# EAGLE schematic a2402-4069-overdrive (EAGLE 7.5.0)
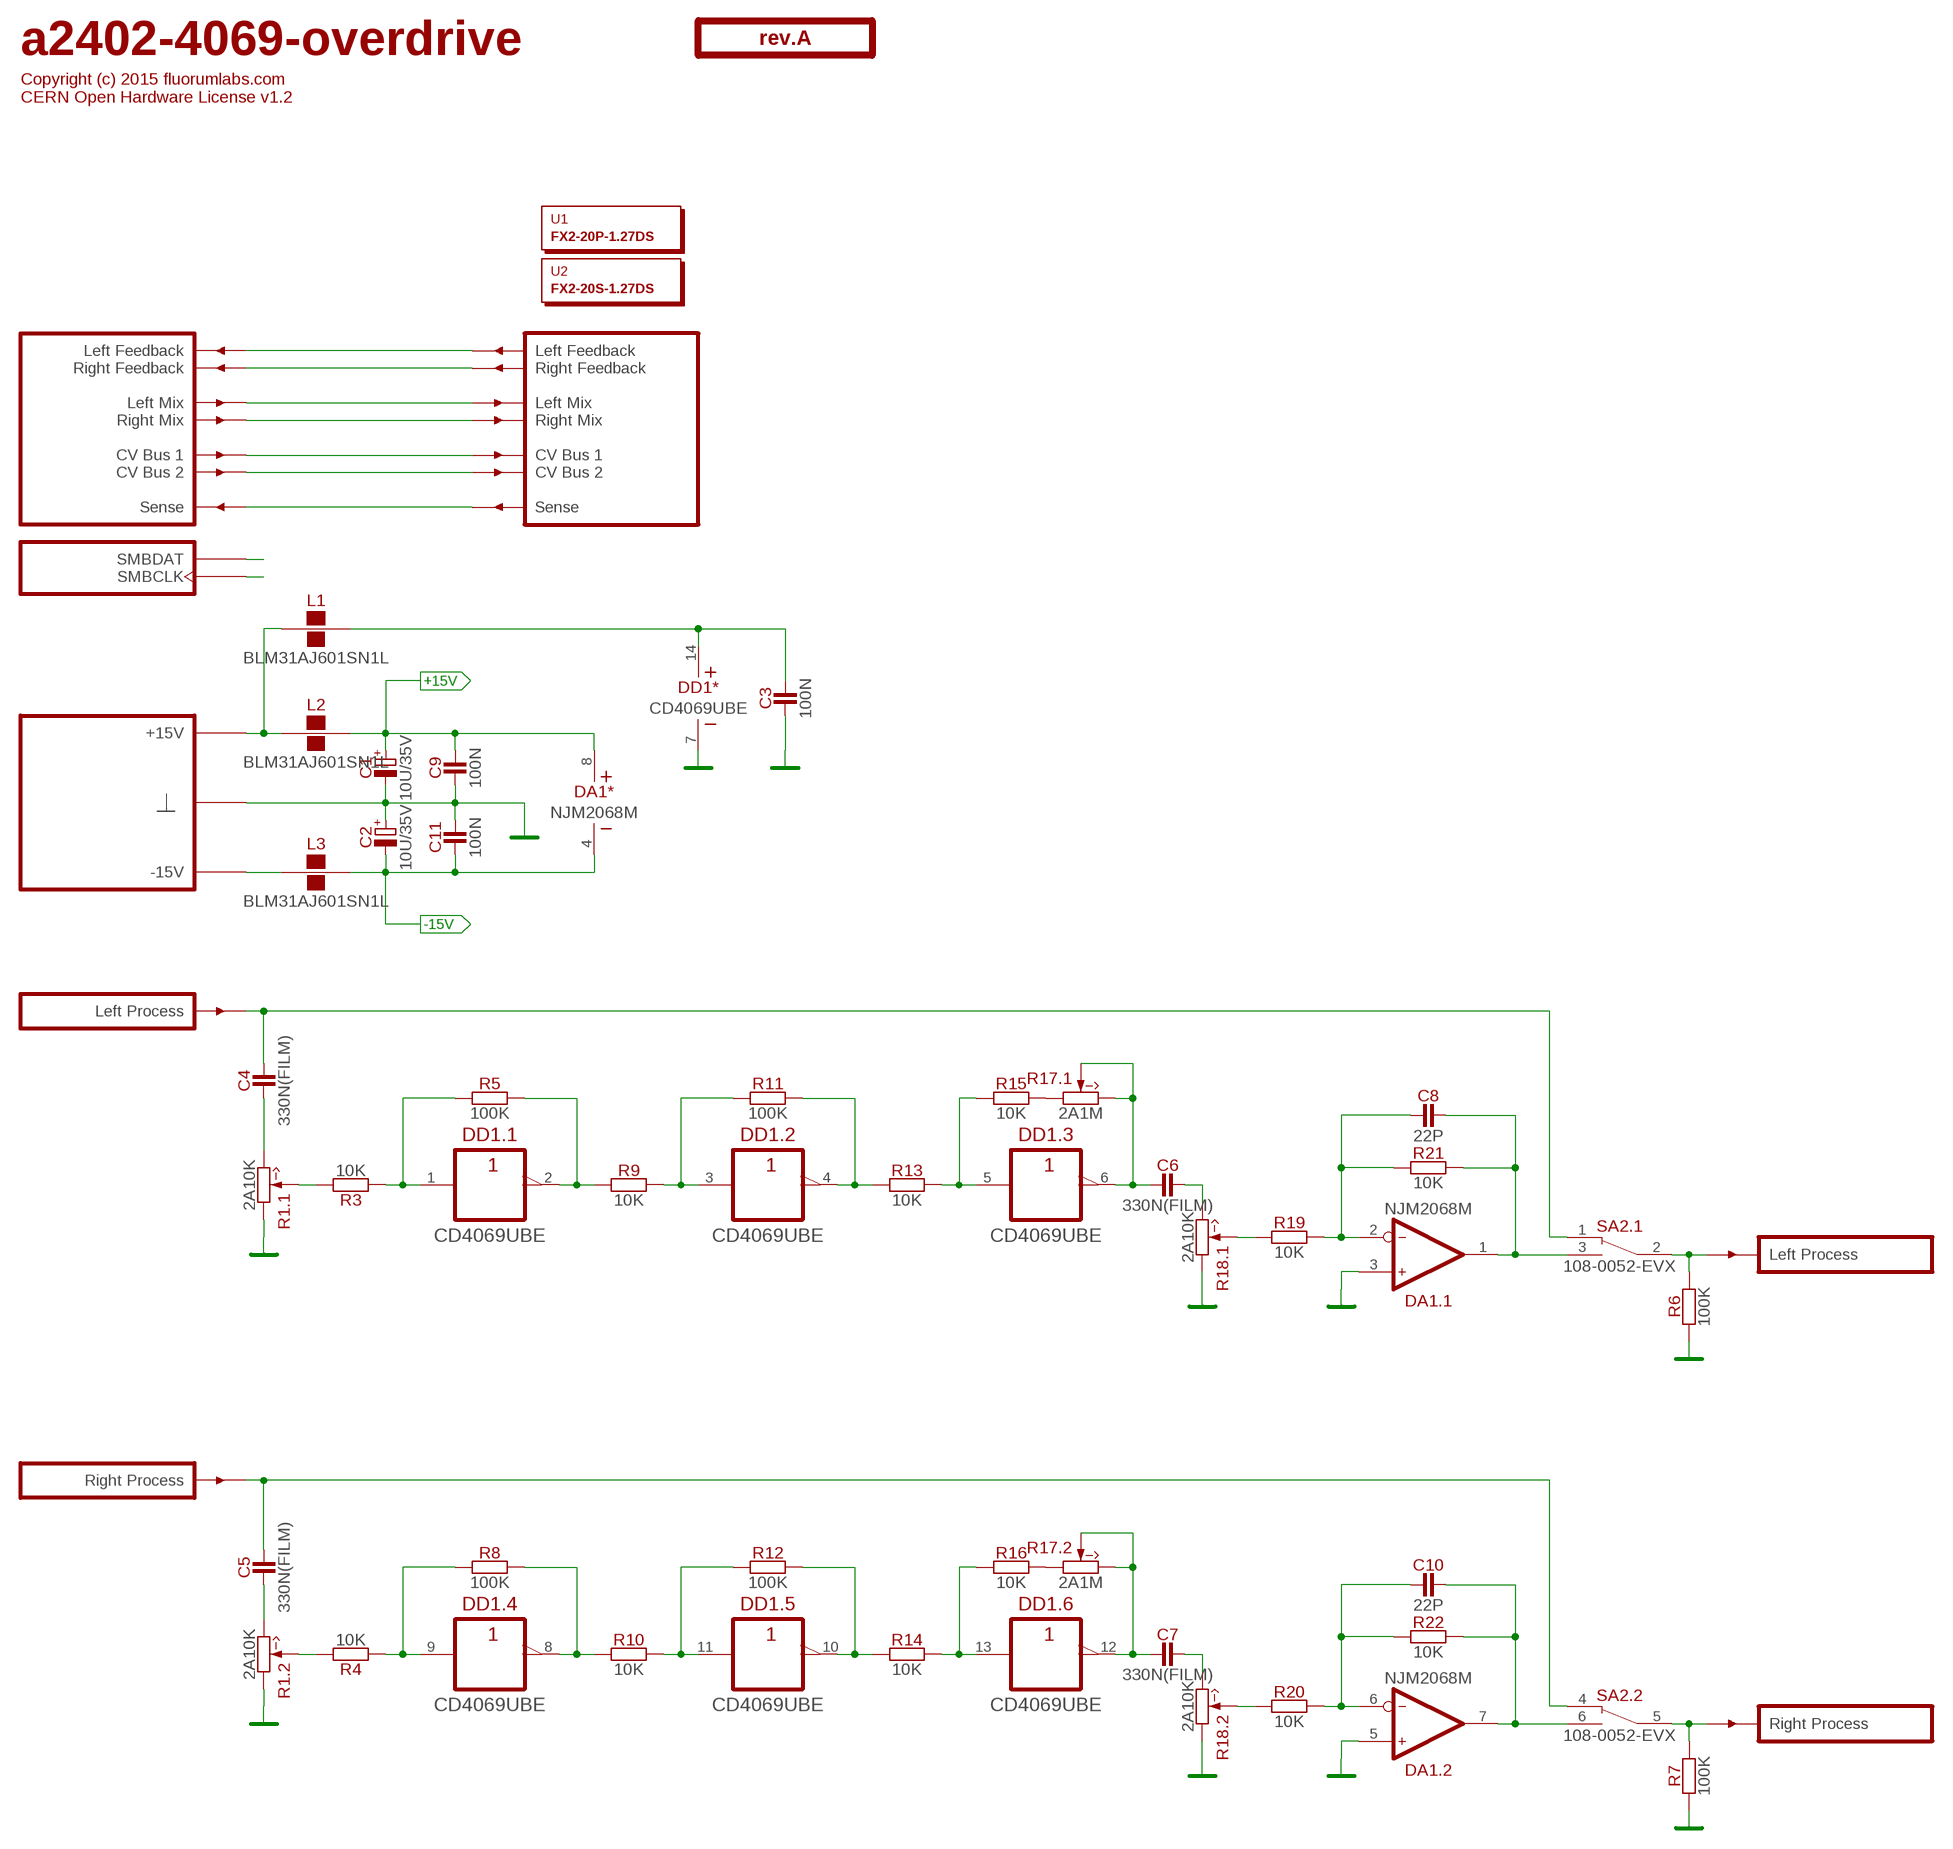
[diagram p0: schematic, sheet 1]

## Parts
C1  10U/35V  [E2-5]
C2  10U/35V  [E2-5]
C3  100N  [C-0805]
C4  330N(FILM)  [C050-035X075]
C5  330N(FILM)  [C050-035X075]
C6  330N(FILM)  [C050-035X075]
C7  330N(FILM)  [C050-035X075]
C8  22P  [C-0805]
C9  100N  [C-0805]
C10  22P  [C-0805]
C11  100N  [C-0805]
DA1  NJM2068M  [SO-8]
DD1  CD4069UBE  [DIP-14]
L1  BLM31AJ601SN1L  [1206]
L2  BLM31AJ601SN1L  [1206]
L3  BLM31AJ601SN1L  [1206]
O1  TITLE  [EMPTY]
PCB1  rev.A  ST2-BOARD-50  [ST2-BOARD-50]
R1  2A10K  [RV11-DUAL]
R3  10K  [R-0805]
R4  10K  [R-0805]
R5  100K  [R-0805]
R6  100K  [R-0805]
R7  100K  [R-0805]
R8  100K  [R-0805]
R9  10K  [R-0805]
R10  10K  [R-0805]
R11  100K  [R-0805]
R12  100K  [R-0805]
R13  10K  [R-0805]
R14  10K  [R-0805]
R15  10K  [R-0805]
R16  10K  [R-0805]
R17  2A1M  [RV11-DUAL]
R18  2A10K  [RV11-DUAL]
R19  10K  [R-0805]
R20  10K  [R-0805]
R21  10K  [R-0805]
R22  10K  [R-0805]
SA2  108-0052-EVX  [108-0052-EVX]
U1  FX2-20P-1.27DS  [EMPTY]
U2  FX2-20S-1.27DS  [EMPTY]

## Nets
+15V [power]: C1.+ C9.2 DA1.8(*:V+) L2.2
-15V [power]: C2.- C11.1 DA1.4(*:V-) L3.2
FBK_LEFT: PCB1.ALFBK'(LFBK') PCB1.ALFBK(LFBK)
FBK_RIGHT: PCB1.ARFBK'(RFBK') PCB1.ARFBK(RFBK)
GND: C1.- C2.+ C3.1 C9.1 C11.2 DA1.3(.1:IN+) DA1.5(.2:IN+) DD1.7(*:V-) PCB1.B4'(GND) PCB1.B4(GND) PCB1.B5'(GND) PCB1.B5(GND) PCB1.B6'(GND) PCB1.B6(GND) PCB1.B7'(GND) PCB1.B7(GND) PCB1.B8'(GND) PCB1.B8(GND) R1.1'(.2:CCW) R1.1(.1:CCW) R6.2 R7.2 R18.1'(.2:CCW) R18.1(.1:CCW)
LMIX: PCB1.ALMIX'(LMIX') PCB1.ALMIX(LMIX)
N$1: C3.2 DD1.14(*:V+) L1.2
N$2: R15.2 R17.1(.1:CCW)
N$3: R16.2 R17.1'(.2:CCW)
N$4: C4.2 PCB1.BINL(INL) SA2.1(.1:NC)
N$5: C4.1 R1.3(.1:CW)
N$6: DD1.1(.1:A) R3.1 R5.1
N$7: DD1.2(.1:Y) R5.2 R9.1
N$8: DD1.3(.2:A) R9.2 R11.1
N$9: DD1.4(.2:Y) R11.2 R13.1
N$10: DD1.5(.3:A) R13.2 R15.1
N$11: C6.1 DD1.6(.3:Y) R17.2(.1:W) R17.3(.1:CW)
N$12: C6.2 R18.3(.1:CW)
N$13: R18.2(.1:W) R19.1
N$14: C8.1 DA1.2(.1:IN-) R19.2 R21.1
N$15: R1.2(.1:W) R3.2
N$16: PCB1.BSENSE'(SENSE') PCB1.BSENSE(SENSE)
N$17: C8.2 DA1.1(.1:OUT) R21.2 SA2.3(.1:NO)
N$18: C5.1 R1.3'(.2:CW)
N$19: C5.2 PCB1.BINR(INR) SA2.4(.2:NC)
N$20: R1.2'(.2:W) R4.2
N$21: DD1.9(.4:A) R4.1 R8.1
N$22: DD1.8(.4:Y) R8.2 R10.1
N$23: DD1.11(.5:A) R10.2 R12.1
N$24: DD1.10(.5:Y) R12.2 R14.1
N$25: PCB1.BOUTR'(OUTR) R7.1 SA2.5(.2:CM)
N$26: DD1.13(.6:A) R14.2 R16.1
N$27: C7.1 DD1.12(.6:Y) R17.2'(.2:W) R17.3'(.2:CW)
N$28: PCB1.BOUTL'(OUTL) R6.1 SA2.2(.1:CM)
N$29: C7.2 R18.3'(.2:CW)
N$30: R18.2'(.2:W) R20.1
N$31: C10.1 DA1.6(.2:IN-) R20.2 R22.1
N$32: C10.2 DA1.7(.2:OUT) R22.2 SA2.6(.2:NO)
N$36: L3.1 PCB1.A-15'(P-15V) PCB1.A-15(P-15V) PCB1.B-15'(P-15V) PCB1.B-15(P-15V)
N$38: PCB1.ASMBDAT'(SMBDAT) PCB1.ASMBDAT(SMBDAT)
N$41: PCB1.ACV1'(CV1') PCB1.ACV1(CV1)
N$42: PCB1.ACV2'(CV2') PCB1.ACV2(CV2)
N$43: PCB1.ASMBCLK'(SMBCLK) PCB1.ASMBCLK(SMBCLK)
P+15V: L1.1 L2.1 PCB1.A+15'(P+15V) PCB1.A+15(P+15V) PCB1.B+15'(P+15V) PCB1.B+15(P+15V)
RMIX: PCB1.ARMIX'(RMIX') PCB1.ARMIX(RMIX)

## Library data of the parts
C1 C2 = capacitors-electrolytic:?; MOUSER: 647-USW1V100MDD
C3 C9 C11 = capacitors:?; MOUSER: 77-VJ0805V104MXBPBC
C4-C7 = capacitors:?; MOUSER: 505-MKS2.33/63/10
C8 C10 = capacitors:?; MOUSER: 77-VJ0805A220GXACBC
DA1 = ic-jrc:NJM2068; MOUSER: 513-NJM2068M
DD1 = ic-logic:CD4069UB
L1-L3 = inductors:BLM31AJ601SN1L; MOUSER: 81-BLM31AJ601SN1L
O1 = text:TITLE
PCB1 = module-footprints:ST2-BOARD-50
R1 R18 = potentiometers:2**?; MOUSER: 688-RK12L12C0A0E
R3 R4 R9 R10 R13-R16 R19-R22 = resistors:?; MOUSER: 660-RK73H2ATTD1002F
R5-R8 R11 R12 = resistors:?; MOUSER: 660-RK73H2ATTD1003F
R17 = potentiometers:2**?; MOUSER: 317-2102F-1M
SA2 = switches:108-0052-EVX; MOUSER: 108-0052-EVX
U1 = hardware:?; MOUSER: 798-FX2-20P-1.27DS71
U2 = hardware:?; MOUSER: 798-FX2-20S-1.27DS71